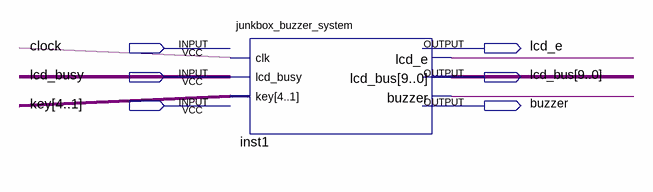
[diagram p0: schematic sheet]
// Quartus schematic jukebox_manager.bdf as structural Verilog: 1 symbols, 6 pins
module jukebox_manager (
  input  clock,
  input  lcd_busy,
  input  [4:1] key,
  output lcd_e,
  output [9:0] lcd_bus,
  output buzzer
);

  wire inst1_buzzer, inst1_lcd_e, undriven;
  wire [3:0] undriven_2;
  wire [9:0] inst1_lcd_bus;

  junkbox_buzzer_system inst1 (
    .clk(undriven), .lcd_busy(lcd_busy), .key(undriven_2), .lcd_e(inst1_lcd_e), .lcd_bus(inst1_lcd_bus),
    .buzzer(inst1_buzzer));
endmodule
